# EAGLE design BMS-LV (EAGLE 6.6.0)
GLVS Battery Management System
DATABASE: D:\Greg\Dropbox\EV (1)\2016 Hardware\partsdb.txt
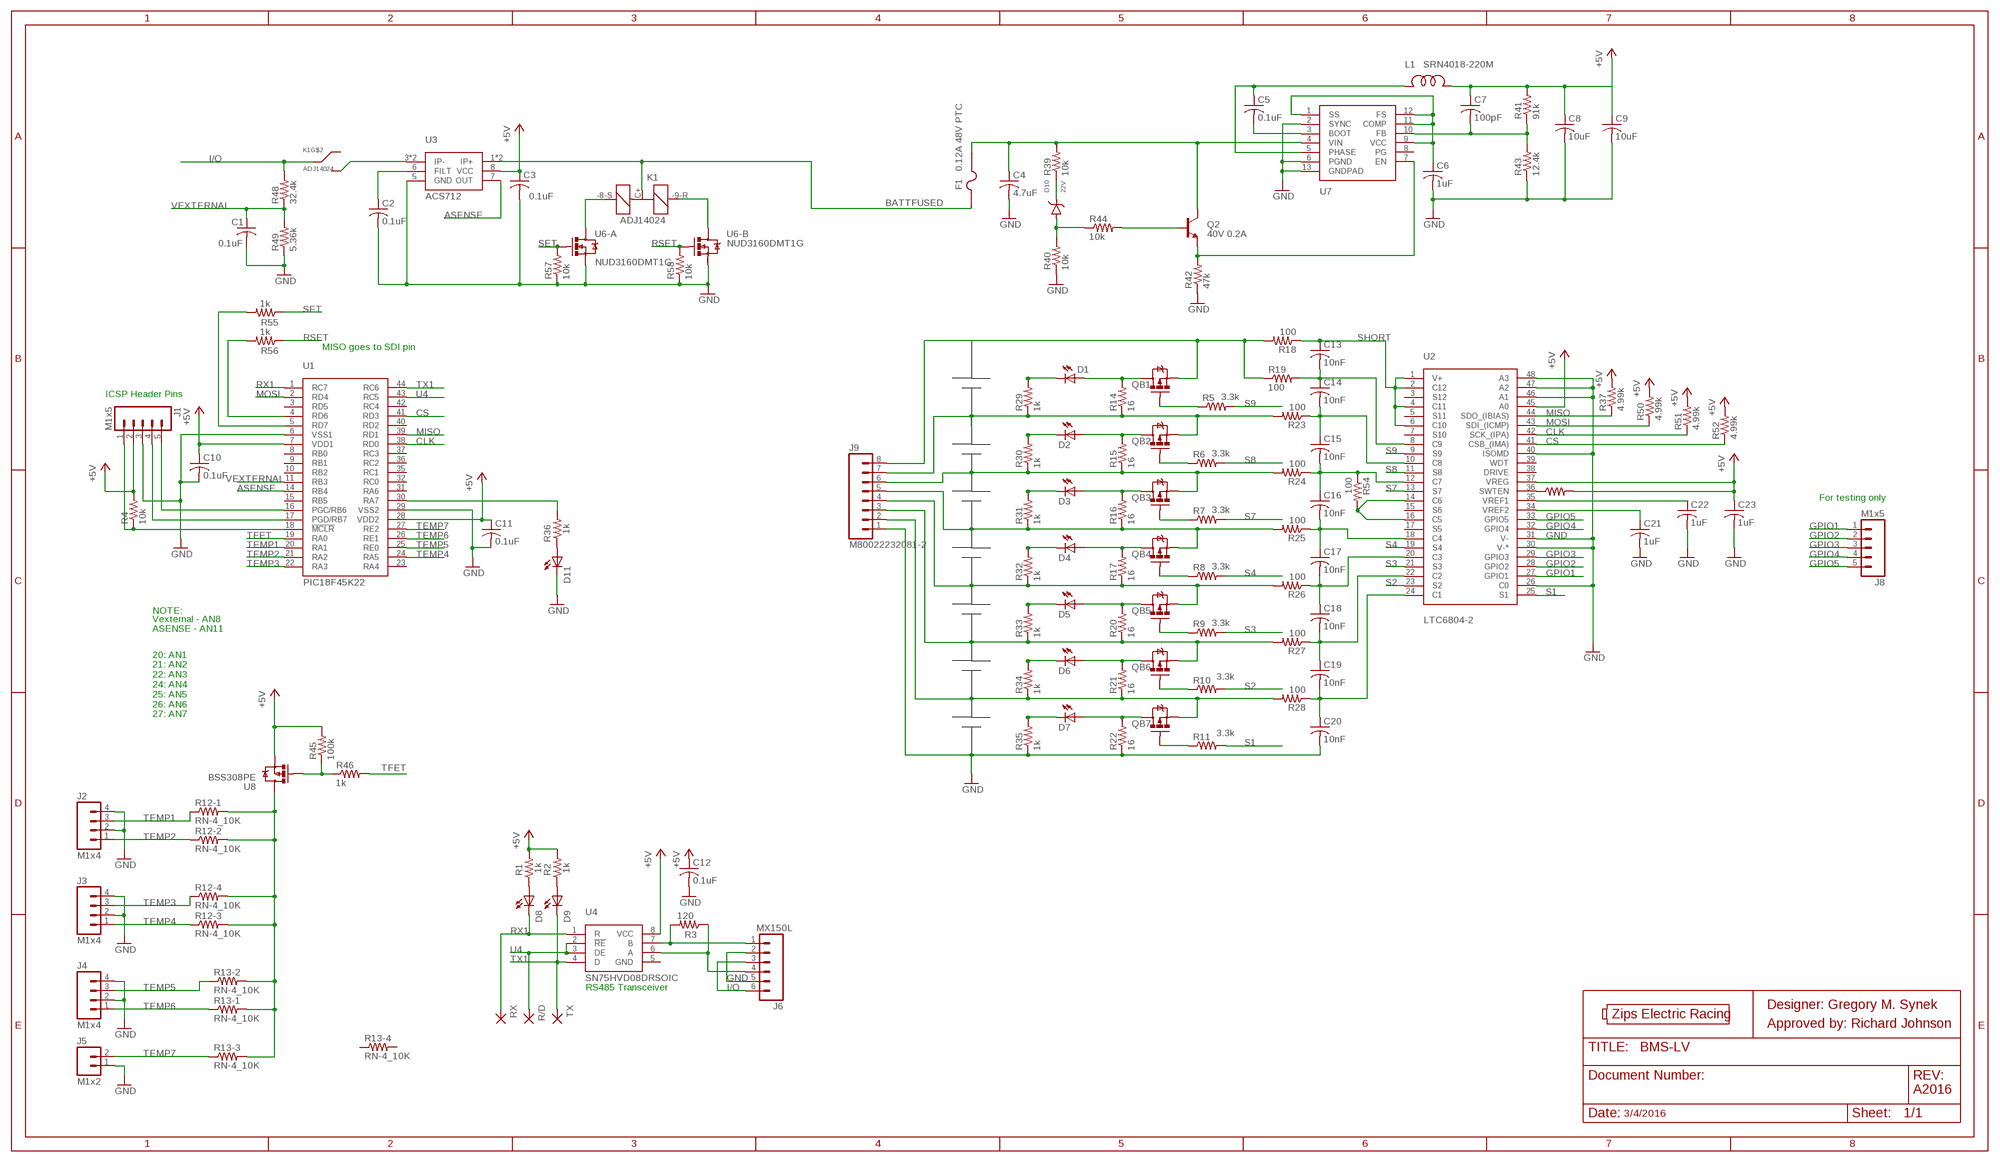
[diagram p0: schematic, sheet 1]

## Parts
C1  0.1uF  CAP_0.1UF_50V  [0603]
C2  0.1uF  CAP_0.1UF_100V  [0805]
C3  0.1uF  CAP_0.1UF_50V  [0603]
C4  4.7uF  CAP_4.7UF_50V  [1206@1]
C5  0.1uF  CAP_0.1UF_50V  [0603]
C6  1uF  CAP_1UF_50V_0805  [0805]
C7  100pF  CAP_100PF_50V  [0603]
C8  10uF  CAP_10UF_50V  [1206@1]
C9  10uF  CAP_10UF_50V  [1206@1]
C10  0.1uF  CAP_0.1UF_50V  [0603]
C11  0.1uF  CAP_0.1UF_50V  [0603]
C12  0.1uF  CAP_0.1UF_50V  [0603]
C13  10nF  CAP_10NF_50V  [0603]
C14  10nF  CAP_10NF_50V  [0603]
C15  10nF  CAP_10NF_50V  [0603]
C16  10nF  CAP_10NF_50V  [0603]
C17  10nF  CAP_10NF_50V  [0603]
C18  10nF  CAP_10NF_50V  [0603]
C19  10nF  CAP_10NF_50V  [0603]
C20  10nF  CAP_10NF_50V  [0603]
C21  1uF  CAP_1UF_50V_0805  [0805]
C22  1uF  CAP_1UF_50V_0805  [0805]
C23  1uF  CAP_1UF_50V_0805  [0805]
D1  LED_GREEN  [CHIP_LED0805]
D2  LED_GREEN  [CHIP_LED0805]
D3  LED_GREEN  [CHIP_LED0805]
D4  LED_GREEN  [CHIP_LED0805]
D5  LED_GREEN  [CHIP_LED0805]
D6  LED_GREEN  [CHIP_LED0805]
D7  LED_GREEN  [CHIP_LED0805]
D8  LED_AMBER  [CHIP_LED0805]
D9  LED_GREEN  [CHIP_LED0805]
D10  22V  DIODE-ZENER_22V  [SOD-323]
D11  LED_AMBER  [CHIP_LED0805]
F1  0.12A 48V PTC  FUSE_0.12A_48V_PTC  [1206@1]
J1  M1x5  M5GENERIC  [5X.1]
J2  M1x4  M4_1X4_LOCK  [MOLEX_1X4]
J3  M1x4  M4_1X4_LOCK  [MOLEX_1X4]
J4  M1x4  M4_1X4_LOCK  [MOLEX_1X4]
J5  M1x2  M2M1X2  [MOLEX-1X2]
J6  MX150L  M2X3MX150L  [MOLEX-MX150L]
J8  M1x5  M5GENERIC  [5X.1]
J9  M80022232081-2  [MOLEX-1X8-2]
K1  ADJ14024  [ADJ14024]
L1  SRN4018-220M  [SRN4018]
Q2  40V 0.2A  NPN_40V_0.2A  [SOT23]
QB1  MOS-P_DMP2305U-7  [SOT23]
QB2  MOS-P_DMP2305U-7  [SOT23]
QB3  MOS-P_DMP2305U-7  [SOT23]
QB4  MOS-P_DMP2305U-7  [SOT23]
QB5  MOS-P_DMP2305U-7  [SOT23]
QB6  MOS-P_DMP2305U-7  [SOT23]
QB7  MOS-P_DMP2305U-7  [SOT23]
R1  1k  RES_1K_5%  [0603]
R2  1k  RES_1K_5%  [0603]
R3  120  RES_120_1%  [0603]
R4  10k  RES_10K_1%  [0603]
R5  3.3k  RES_3.3K_1%_0805  [0805]
R6  3.3k  RES_3.3K_1%_0805  [0805]
R7  3.3k  RES_3.3K_1%_0805  [0805]
R8  3.3k  RES_3.3K_1%_0805  [0805]
R9  3.3k  RES_3.3K_1%_0805  [0805]
R10  3.3k  RES_3.3K_1%_0805  [0805]
R11  3.3k  RES_3.3K_1%_0805  [0805]
R12  RN-4_10K  [MNR14]
R13  RN-4_10K  [MNR14]
R14  16  RES_16_5%_TH  [RR02J16RTB]
R15  16  RES_16_5%_TH  [RR02J16RTB]
R16  16  RES_16_5%_TH  [RR02J16RTB]
R17  16  RES_16_5%_TH  [RR02J16RTB]
R18  100  RES_100_1%  [0603]
R19  100  RES_100_1%  [0603]
R20  16  RES_16_5%_TH  [RR02J16RTB]
R21  16  RES_16_5%_TH  [RR02J16RTB]
R22  16  RES_16_5%_TH  [RR02J16RTB]
R23  100  RES_100_1%  [0603]
R24  100  RES_100_1%  [0603]
R25  100  RES_100_1%  [0603]
R26  100  RES_100_1%  [0603]
R27  100  RES_100_1%  [0603]
R28  100  RES_100_1%  [0603]
R29  1k  RES_1K_5%  [0603]
R30  1k  RES_1K_5%  [0603]
R31  1k  RES_1K_5%  [0603]
R32  1k  RES_1K_5%  [0603]
R33  1k  RES_1K_5%  [0603]
R34  1k  RES_1K_5%  [0603]
R35  1k  RES_1K_5%  [0603]
R36  1k  RES_1K_5%  [0603]
R37  4.99k  RES_4.99K_1%  [0603]
R39  10k  RES_10K_1%  [0603]
R40  10k  RES_10K_1%  [0603]
R41  91k  RES_91K_1%_0805  [0805]
R42  47k  RES_47K_1%  [0603]
R43  12.4k  RES_12.4K_1%  [0603]
R44  10k  RES_10K_1%  [0603]
R45  100k  RES_100K_1%_0805  [0805]
R46  1k  RES_1K_1%_0805  [0805]
R47  RES_0_1%  [0603]
R48  32.4k  RES_32.4K_1%  [0603]
R49  5.36k  RES_5.36K_1%  [0603]
R50  4.99k  RES_4.99K_1%  [0603]
R51  4.99k  RES_4.99K_1%  [0603]
R52  4.99k  RES_4.99K_1%  [0603]
R54  100  RES_1K_1%_0805  [0805]
R55  1k  RES_1K_5%  [0603]
R56  1k  RES_1K_5%  [0603]
R57  10k  RES_10K_1%  [0603]
R58  10k  RES_10K_1%  [0603]
R/D  TPSMD  [0603]
RX  TPSMD  [0603]
TX  TPSMD  [0603]
U1  PIC18F45K22  [TQFP-44]
U2  LTC6804-2  [SSOP-48]
U3  ACS712  ACS712ELCTR-30A-T  [SO-8]
U4  SN75HVD08DRSOIC  [SO-8]
U6  NUD3160DMT1G  [SC74-6]
U7  ISL85415-FRZ-T7A  [DFN-12]
U8  BSS308PE  BSS308PEBSS308PE  [SOT23]

## Nets
+5V: C3.1(+) C7.1(+) C8.1(+) C9.1(+) C10.1(+) C11.1(+) C12.1(+) C23.1(+) J1.2 L1.P$2 R1.2 R2.2 R4.2 R37.2 R41.2 R45.2 R47.2 R50.2 R51.2 R52.2 U1.7(VDD1) U1.28(VDD2) U2.37(VREG) U2.45(A0) U3.8(VCC) U4.8(VCC) U8.3(S)
ASENSE: U1.14(RB4) U3.7(OUT)
BATTFUSED: F1.1 K1.C+(-) U3.1(IP+) U3.2(IP+)
BATTPACK+: J9.8 QB1.3(S) R18.2 R19.1
CLK: R51.1 U1.38(RD0) U2.42(SCK_(IPA))
CS: R52.1 U1.41(RD3) U2.41(CSB_(IMA))
GND: C1.2(-) C2.2(-) C3.2(-) C4.2(-) C6.2(-) C8.2(-) C9.2(-) C10.2(-) C11.2(-) C12.2(-) C20.2(-) C21.2(-) C22.2(-) C23.2(-) D11.C J1.3 J2.2 J2.4 J3.2 J3.4 J4.2 J4.4 J5.1 J6.2 J6.5 J9.1 R22.P$1 R35.1 R40.1 R42.1 R43.1 R49.1 R57.1 R58.1 U1.6(VSS1) U1.29(VSS2) U2.26(C0) U2.30(V-*) U2.31(V-) U2.40(ISOMD) U2.46(A1) U2.47(A2) U2.48(A3) U3.5(GND) U6.1(-A:S) U6.4(-B:S) U7.2(SYNC) U7.6(PGND) U7.13(GNDPAD)
GPIO1: J8.1 U2.27(GPIO1)
GPIO2: J8.2 U2.28(GPIO2)
GPIO3: J8.3 U2.29(GPIO3)
GPIO4: J8.4 U2.32(GPIO4)
GPIO5: J8.5 U2.33(GPIO5)
I/O: J6.3 J6.6 K1.C R48.2
MISO: R37.1 U1.39(RD1) U2.44(SDO_(IBIAS))
MOSI: R50.1 U1.2(RD4) U2.43(SDI_(ICMP))
N$1: D8.A R1.1
N$2: C13.2(-) C14.1(+) R19.2 U2.8(C9)
N$3: D9.A R2.1
N$4: C14.2(-) C15.1(+) R23.1 U2.10(C8)
N$5: D11.A R36.1
N$6: R55.2 U1.5(RD7)
N$7: K1.-8-S(+1) U6.6(-A:D)
N$9: C15.2(-) C16.1(+) R24.1 R54.1 U2.12(C7)
N$10: J1.4 U1.17(PGD/RB7)
N$11: R45.1 R46.1 U8.1(G)
N$12: R47.1 U2.36(SWTEN)
N$13: D1.C R29.2
N$14: R36.2 U1.30(RA7)
N$15: K1.NO U3.3(IP-) U3.4(IP-)
N$16: C17.2(-) C18.1(+) R26.1 U2.20(C3)
N$18: R54.2 U2.14(C6) U2.16(C5)
N$19: R56.2 U1.4(RD6)
N$20: K1.-9-R(+2) U6.3(-B:D)
N$22: D2.C R30.2
N$24: C4.1(+) F1.2 Q2.3 R39.2 U7.4(VIN)
N$27: C2.1(+) U3.6(FILT)
N$28: D10.P$2(A) R40.2 R44.1
N$29: J6.4 R3.1 U4.6(A)
N$30: D10.P$1(C) R39.1
N$31: Q2.2 R42.2 U7.7(EN)
N$32: C5.2(-) U7.3(BOOT)
N$33: J6.1 R3.2 U4.7(B)
N$34: J9.2 QB7.3(S) R21.P$1 R28.2 R34.1
N$35: C6.1(+) U7.1(SS) U7.9(VCC) U7.11(COMP) U7.12(FS)
N$36: C5.1(+) L1.P$1 U7.5(PHASE)
N$38: C18.2(-) C19.1(+) R27.1 U2.22(C2)
N$39: J1.5 U1.16(PGC/RB6)
N$40: C19.2(-) C20.1(+) R28.1 U2.24(C1)
N$41: D3.C R31.2
N$42: Q2.1 R44.2
N$43: D4.C R32.2
N$44: D5.C R33.2
N$46: QB5.1(G) R9.1
N$47: D6.C R34.2
N$48: D5.A QB5.2(D) R20.P$2
N$49: QB3.1(G) R7.1
N$50: J9.3 QB6.3(S) R20.P$1 R27.2 R33.1
N$52: QB7.1(G) R11.1
N$53: J9.4 QB5.3(S) R17.P$1 R26.2 R32.1
N$54: D7.A QB7.2(D) R22.P$2
N$56: D7.C R35.2
N$57: QB6.1(G) R10.1
N$58: J1.1 R4.1 U1.18(!MCLR)
N$64: D6.A QB6.2(D) R21.P$2
N$66: C7.2(-) R41.1 R43.2 U7.10(FB)
N$67: J9.7 QB2.3(S) R14.P$1 R23.2 R29.1
N$68: J9.6 QB3.3(S) R15.P$1 R24.2 R30.1
N$69: J9.5 QB4.3(S) R16.P$1 R25.2 R31.1
N$70: QB1.1(G) R5.1
N$71: D1.A QB1.2(D) R14.P$2
N$72: QB2.1(G) R6.1
N$73: D2.A QB2.2(D) R15.P$2
N$74: D3.A QB3.2(D) R16.P$2
N$76: QB4.1(G) R8.1
N$77: D4.A QB4.2(D) R17.P$2
N$78: R12.5 R12.6 R12.7 R12.8 R13.6 R13.7 R13.8 U8.2(D)
N$79: C16.2(-) C17.1(+) R25.1 U2.18(C4)
RSET: R56.1 R58.2 U6.5(-B:G)
RX1: D8.C RX.1 RX.2 U1.1(RC7) U4.1(R)
S1: R11.2 U2.25(S1)
S2: R10.2 U2.23(S2)
S3: R9.2 U2.21(S3)
S4: R8.2 U2.19(S4)
S7: R7.2 U2.13(S7)
S8: R6.2 U2.11(S8)
S9: R5.2 U2.9(S9)
SET: R55.1 R57.2 U6.2(-A:G)
SHORT: C13.1(+) R18.1 U2.1(V+) U2.2(C12) U2.4(C11) U2.6(C10)
TEMP1: J2.3 R12.1 U1.20(RA1)
TEMP2: J2.1 R12.2 U1.21(RA2)
TEMP3: J3.3 R12.4 U1.22(RA3)
TEMP4: J3.1 R12.3 U1.24(RA5)
TEMP5: J4.3 R13.2 U1.25(RE0)
TEMP6: J4.1 R13.1 U1.26(RE1)
TEMP7: J5.2 R13.3 U1.27(RE2)
TFET: R46.2 U1.19(RA0)
TX1: D9.C TX.1 TX.2 U1.44(RC6) U4.4(D)
U4: R/D.1 R/D.2 U1.43(RC5) U4.2(!RE) U4.3(DE)
VEXTERNAL: C1.1(+) R48.1 R49.2 U1.11(RB3)
VREF1: C22.1(+) U2.35(VREF1)
VREF2: C21.1(+) U2.34(VREF2)
Unconnected: K1.NC R13.4 R13.5 U1.3(RD5) U1.8(RB0) U1.9(RB1) U1.10(RB2) U1.15(RB5) U1.23(RA4) U1.31(RA6) U1.32(RC0) U1.35(RC1) U1.36(RC2) U1.37(RC3) U1.40(RD2) U1.42(RC4) U2.3(S12) U2.5(S11) U2.7(S10) U2.15(S6) U2.17(S5) U2.38(DRIVE) U2.39(WDT) U4.5(GND) U7.8(PG)

## Notes on the sheet
- MISO goes to SDI pin
- ICSP Header Pins
- For testing only
- NOTE:
- Vexternal - AN8
  ASENSE - AN11
- 20: AN1
  21: AN2
  22: AN3
  24: AN4
  25: AN5
  26: AN6
  27: AN7
- RS485 Transceiver
- Designer: Gregory M. Synek
- Zips Electric Racing
- Approved by: Richard Johnson
- A2016
- 3/4/2016

## Library data of the parts
C1 C3 C5 C10-C12 = FSAE Electric:CAP; PARTNO: CC0603ZRY5V9BB104
C2 = FSAE Electric:CAP; PARTNO: CL21B104KCC5PNC
C4 = FSAE Electric:CAP; PARTNO: GRM31CF51H475ZA01L
C6 C21-C23 = FSAE Electric:CAP; PARTNO: UMK212F105ZG-T
C7 = FSAE Electric:CAP; PARTNO: C1608C0G1H101J080AA
C8 C9 = FSAE Electric:CAP; PARTNO: CL31A106KBHNNNE
C13-C20 = FSAE Electric:CAP; PARTNO: CL10F103ZB8NNNC
D1-D7 D9 = FSAE Electric:LED; PARTNO: LTST-S220GKT
D8 D11 = FSAE Electric:LED; PARTNO: HSMA-C170
D10 = FSAE Electric:DIODE-ZENER: Zener Diodes; PARTNO: MM3Z22VT1G
F1 = FSAE Electric:FUSE; PARTNO: 0ZCJ0012FF2E
J1 J8 = FSAE Electric:M5: Molex 5-Pin Connectors; PARTNO: GENERIC
J2-J4 = FSAE Electric:M4: Molex 1x4 Connectors; PARTNO: 0022232041
J5 = FSAE Electric:M2; PARTNO: 0022232021
J6 = FSAE Electric:M2X3: Molex 2x3 Pin Connectors; PARTNO: 19427-0018
J9 = FSAE Electric:M8: Molex 8-pin Connectors; PARTNO: 0022232081
K1 = FSAE Electric:ADJ14024: General Purpose Relay SPDT 16A 24V View on DigiKey <http://www.digikey.com/product-search/en?keywords=ADJ14024>; PARTNO: ADJ14024
L1 = FSAE Electric:SRN4018: Fixed Inductor; PARTNO: SRN4018-220M
Q2 = FSAE Electric:NPN: NPN Transistors; PARTNO: MMBT3904LT1G
QB1-QB7 = FSAE Electric:MOS-P: P-Channel Mosfets; PARTNO: DMP2305U-7
R1 R2 R29-R36 R55 R56 = FSAE Electric:RES: Resistors; PARTNO: RC0603JR-071KL
R3 = FSAE Electric:RES: Resistors; PARTNO: RC0603FR-07120RL
R4 R39 R40 R44 R57 R58 = FSAE Electric:RES: Resistors; PARTNO: RC0603FR-0710KL
R5-R11 = FSAE Electric:RES: Resistors; PARTNO: RC0805FR-073K3L
R12 R13 = FSAE Electric:RN-4; PARTNO: MNR14ERAPJ103
R14-R17 R20-R22 = FSAE Electric:RES: Resistors; PARTNO: RR02J16RTB
R18 R19 R23-R28 = FSAE Electric:RES: Resistors; PARTNO: RC0603FR-07100RL
R37 R50-R52 = FSAE Electric:RES: Resistors; PARTNO: ERJ-3EKF4991V
R41 = FSAE Electric:RES: Resistors; PARTNO: ERJ-6ENF9102V
R42 = FSAE Electric:RES: Resistors; PARTNO: RC0603FR-0747KL
R43 = FSAE Electric:RES: Resistors; PARTNO: RC0603FR-0712K4L
R45 = FSAE Electric:RES: Resistors; PARTNO: RC0805FR-07100KL
R46 R54 = FSAE Electric:RES: Resistors; PARTNO: RC0805FR-071KL
R47 = FSAE Electric:RES: Resistors; PARTNO: CRCW06030000Z0EA
R48 = FSAE Electric:RES: Resistors; PARTNO: RC0603FR-0732K4L
R49 = FSAE Electric:RES: Resistors; PARTNO: RC0603FR-075K36L
R/D RX TX = FSAE Electric:TP: SMD test points to make life easy to test / debug; PARTNO: 1625854-3
U1 = FSAE Electric:PIC18F45K22: Microprocessor used in many places on the car View on DigiKey <http://www.digikey.com/product-detail/en/PIC18F45K22T-I%2FPT/PIC18F45K22T-I%2FPTCT-ND/5169582>; PARTNO: PIC18F45K22T-I/PT
U2 = FSAE Electric:LTC6804: The LTC6804 is a multicell battery stack monitor that measures up to 12 series connected battery cells with a total measurement error of less than 1.2mV. The cell measurement range of 0V to 5V makes the LTC6804 suitable for most battery chemistries. All 12 cell voltages can be captured in 290µs, and lower data acquisition rates can be selected for high noise reduction; PARTNO: LTC6804IG-2#PBF
U3 = FSAE Electric:ACS712: Hall Effect Current Sensor 30A View on DigiKey <http://www.digikey.com/product-detail/en/ACS712ELCTR-30A-T/620-1191-1-ND/1284608>; PARTNO: ACS712ELCTR-30A-T
U4 = FSAE Electric:SN75HVD08DR: RS485 Transceiver View on DigiKey <http://www.digikey.com/product-detail/en/SN75HVD08DR/296-37893-1-ND/4899996>; PARTNO: SN75HVD08DR
U6 = FSAE Electric:NUD3160DMT1G; PARTNO: NUD3160DMT1G
U7 = FSAE Electric:ISL85415: 5V Buck Regulator IC 500mA 3V-36V View on DigiKey <http://www.digikey.com/product-detail/en/ISL85415FRZ-T7A/ISL85415FRZ-T7ACT-ND/4486023>; PARTNO: ISL85415FRZ-T7A
U8 = FSAE Electric:BSS308PE: P-Ch Mosfet 30V 2A View on DigiKey <http://www.digikey.com/product-detail/en/BSS308PE%20H6327/BSS308PE%20H6327CT-ND/3196649>; PARTNO: BSS308PE H6327

## Board
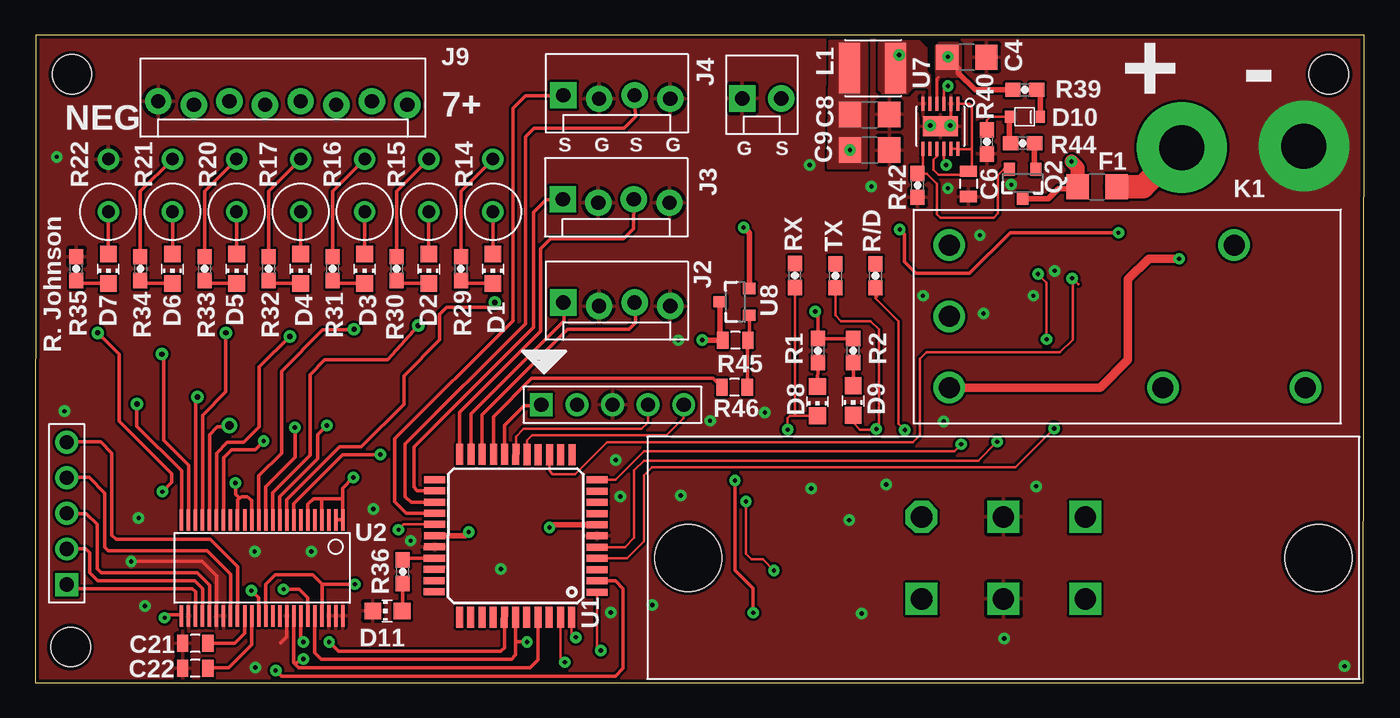
[diagram p1: board, top side]
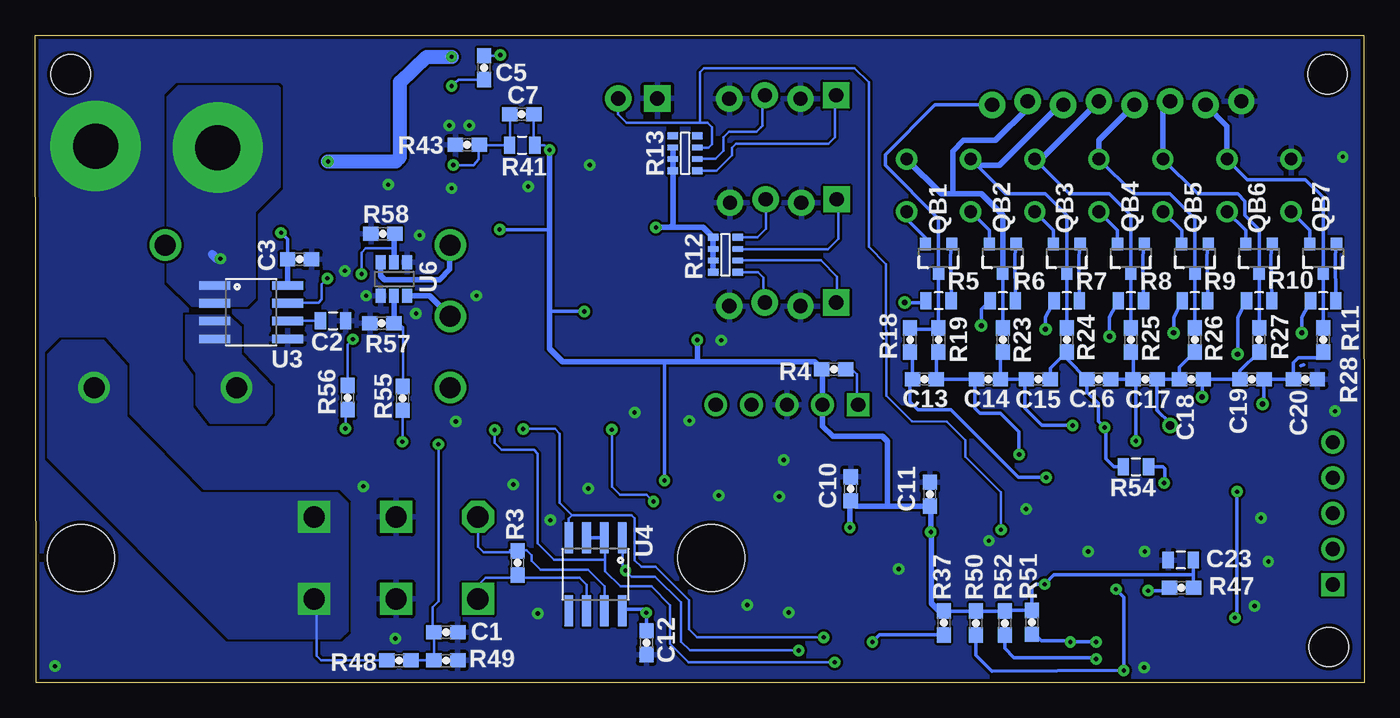
[diagram p2: board, bottom side, seen from below]

Size 94.84 x 46.18 mm. Coordinates in mm from the lower left corner, seen from the top.
Outline: 94.74,0 94.84,46.18 0.05,46.18 0,0 94.74,0
Copper layers (1*16): Top 0.035mm / dielectric 1.5mm / Bottom 0.035mm
Design rules "SparkFun *": minimum track width 7mil, minimum drill 12mil, track to track 7mil, track to pad 7mil, pad to pad 7mil, via to via 7mil, smd to smd 7mil, copper to edge 10mil, drill to drill 7mil, minimum pad ring 12mil, minimum via ring 10mil, stop-mask expansion 4mil, vias tented up to drill 25mil, thermal gap 10mil
Holes 2.8 mm at 92.3,43.38 2.64,43.38 2.54,2.54

### Footprints (pad centres in the part's own frame; a part is rotated, then mirrored left to right if it is on the bottom)
0603 = smd 1.1 x 1: 1 -0.85,0; 2 0.85,0
0805 = smd 0.8 x 1.2: 1 -0.9,0; 2 0.9,0
1206@1 = smd 1.6 x 1.8: 1 -1.4,0; 2 1.4,0
CHIP_LED0805 = smd 1.2 x 1.2: A 0,-1.05; C 0,1.05
SOD-323 = smd 0.65 x 0.85: P$1 -1.1,0; P$2 1.1,0
5X.1 = drill 1.016 square: 1 -5.08,0 | drill 1.016: 2 -2.54,0; 3 0,0; 4 2.54,0; 5 5.08,0
MOLEX_1X4 = drill 1.016 pad 1.88 square: 1 -3.81,0.127 | drill 1.016 pad 1.88: 2 -1.27,-0.127; 3 1.27,0.127; 4 3.81,-0.127
MOLEX-1X2 = drill 1.016 pad 1.88 square: 1 -1.397,0 | drill 1.016 pad 1.88: 2 1.397,0
MOLEX-MX150L = drill 1.524 octagon: 1 -5.842,2.921 | drill 1.524 square: 2 0,2.921; 3 5.842,2.921; 4 -5.842,-2.921; 5 0,-2.921; 6 5.842,-2.921 | hole 4.775: -22.479,0; 22.479,0
MOLEX-1X8-2 = drill 1.016 pad 1.88: 1 -8.89,0; 2 -6.35,-0.254; 3 -3.81,0; 4 -1.27,-0.254; 5 1.27,0; 6 3.81,-0.254; 7 6.35,0; 8 8.89,-0.254
ADJ14024 = drill 1.5: -8-S 0,5.08; -9-R 0,0; C 25.4,-5.08; C+ 0,-5.08; NC 20.32,5.08; NO 15.24,-5.08
SRN4018 = smd 1.5 x 3.6: P$1 -1.6,0; P$2 1.7,0
SOT23 = smd 0.8 x 0.9: 1 -0.95,-1; 2 0.95,-1; 3 0,1.1
MNR14 = smd 0.5 x 0.75: 1 -1.25,-0.9; 4 1.25,-0.9; 5 1.25,0.85; 8 -1.25,0.85 | smd 0.4 x 0.75: 2 -0.4,-0.9; 3 0.4,-0.9; 6 0.4,0.85; 7 -0.4,0.85
RR02J16RTB = drill 0.9: P$1 -3.75,0; P$2 0,0
TQFP-44 = smd 1.5 x 0.5: 1 -5.8,4; 2 -5.8,3.2; 3 -5.8,2.4; 4 -5.8,1.6; 5 -5.8,0.8; 6 -5.8,0; 7 -5.8,-0.8; 8 -5.8,-1.6; 9 -5.8,-2.4; 10 -5.8,-3.2; 11 -5.8,-4; 23 5.8,-4; 24 5.8,-3.2; 25 5.8,-2.4; 26 5.8,-1.6; 27 5.8,-0.8; 28 5.8,0; 29 5.8,0.8; 30 5.8,1.6; 31 5.8,2.4; 32 5.8,3.2; 33 5.8,4 | smd 0.5 x 1.5: 12 -4,-5.8; 13 -3.2,-5.8; 14 -2.4,-5.8; 15 -1.6,-5.8; 16 -0.8,-5.8; 17 0,-5.8; 18 0.8,-5.8; 19 1.6,-5.8; 20 2.4,-5.8; 21 3.2,-5.8; 22 4,-5.8; 34 4,5.8; 35 3.2,5.8; 36 2.4,5.8; 37 1.6,5.8; 38 0.8,5.8; 39 0,5.8; 40 -0.8,5.8; 41 -1.6,5.8; 42 -2.4,5.8; 43 -3.2,5.8; 44 -4,5.8
SSOP-48 = smd 0.25 x 1.524: 1 -5.75,-3.421; 2 -5.25,-3.421; 3 -4.75,-3.421; 4 -4.25,-3.421; 5 -3.75,-3.421; 6 -3.25,-3.421; 7 -2.75,-3.421; 8 -2.25,-3.421; 9 -1.75,-3.421; 10 -1.25,-3.421; 11 -0.75,-3.421; 12 -0.25,-3.421; 13 0.25,-3.421; 14 0.75,-3.421; 15 1.25,-3.421; 16 1.75,-3.421; 17 2.25,-3.421; 18 2.75,-3.421; 19 3.25,-3.421; 20 3.75,-3.421; 21 4.25,-3.421; 22 4.75,-3.421; 23 5.25,-3.421; 24 5.75,-3.421; 25 5.75,3.421; 26 5.25,3.421; 27 4.75,3.421; 28 4.25,3.421; 29 3.75,3.421; 30 3.25,3.421; 31 2.75,3.421; 32 2.25,3.421; 33 1.75,3.421; 34 1.25,3.421; 35 0.75,3.421; 36 0.25,3.421; 37 -0.25,3.421; 38 -0.75,3.421; 39 -1.25,3.421; 40 -1.75,3.421; 41 -2.25,3.421; 42 -2.75,3.421; 43 -3.25,3.421; 44 -3.75,3.421; 45 -4.25,3.421; 46 -4.75,3.421; 47 -5.25,3.421; 48 -5.75,3.421
SO-8 = smd 0.61 x 2.21: 1 -1.905,-2.616; 2 -0.635,-2.616; 3 0.635,-2.616; 4 1.905,-2.616; 5 1.905,2.616; 6 0.635,2.616; 7 -0.635,2.616; 8 -1.905,2.616
SC74-6 = smd 0.7 x 1: 1 -0.95,-1.2; 2 0,-1.2; 3 0.95,-1.2; 4 0.95,1.2; 5 0,1.2; 6 -0.95,1.2
DFN-12 = smd 0.23 x 1: 1 1.25,1.6; 2 0.75,1.6; 3 0.25,1.6; 4 -0.25,1.6; 5 -0.75,1.6; 6 -1.25,1.6; 7 -1.25,-1.6; 8 -0.75,-1.6; 9 -0.25,-1.6; 10 0.25,-1.6; 11 0.75,-1.6; 12 1.25,-1.6 | smd 2.5 x 1.4: 13 0,0

### Placement (x,y rotation side)
C1  65.53,3.58 0.3 bottom
C2  73.58,25.81 0 bottom
C3  75.97,30.18 0 bottom
C4  66.47,44.6 0 top
C5  62.8,43.85 270 bottom
C6  66.6,35.56 270 top
C7  60.12,40.53 180 bottom
C8  59.54,40.51 0 top
C9  59.54,37.97 0 top
C10  36.65,13.82 90 bottom
C11  31.01,13.44 90 bottom
C12  51.23,2.84 270 bottom
C13  31.39,21.64 0 bottom
C14  26.82,21.64 0 bottom
C15  23.27,21.64 0 bottom
C16  18.95,21.64 0 bottom
C17  15.65,21.64 0 bottom
C18  12.34,21.64 0 bottom
C19  8.03,21.64 0 bottom
C20  4.22,21.64 0 bottom
C21  11.43,2.79 180 top
C22  11.43,1.02 180 top
C23  13.11,8.74 180 bottom
D1  32.66,29.51 180 top
D2  28.09,29.51 180 top
D3  23.52,29.51 180 top
D4  18.95,29.51 180 top
D5  14.38,29.51 180 top
D6  9.8,29.51 180 top
D7  5.23,29.51 180 top
D8  55.83,20.07 180 top
D9  58.37,20.12 180 top
D10  70.61,40.36 180 top
D11  25.15,5.11 90 top
F1  75.77,35.36 180 top
J1  41.2,19.81 0 top
J2  41.5,26.97 0 top
J3  41.45,34.34 0 top
J4  41.5,41.76 0 top
J5  51.84,41.66 0 top
J6  69.09,8.89 0 top
J8  2.26,12.06 90 top
J9  17.68,41.45 0 top
K1  65.23,26.11 0 top
L1  59.79,43.81 180 top
Q2  70.46,35.61 180 top
QB1  30.38,30.28 180 bottom
QB2  25.81,30.28 180 bottom
QB3  21.23,30.28 180 bottom
QB4  16.66,30.28 180 bottom
QB5  12.09,30.28 180 bottom
QB6  7.52,30.28 180 bottom
QB7  2.95,30.28 180 bottom
R1  55.85,23.67 90 top
R2  58.37,23.67 90 top
R3  60.43,8.53 90 bottom
R4  37.86,22.34 180 bottom
R5  30.38,27.23 180 bottom
R6  25.81,27.23 180 bottom
R7  21.23,27.23 180 bottom
R8  16.66,27.23 180 bottom
R9  12.09,27.23 180 bottom
R10  7.52,27.23 180 bottom
R11  2.95,27.23 180 bottom
R12  45.62,30.51 90 bottom
R13  48.49,37.74 90 bottom
R14  32.66,33.58 270 top
R15  28.09,33.58 270 top
R16  23.52,33.58 270 top
R17  18.95,33.58 270 top
R18  32.41,24.43 90 bottom
R19  30.38,24.43 270 bottom
R20  14.38,33.58 270 top
R21  9.8,33.58 270 top
R22  5.23,33.58 270 top
R23  25.81,24.43 90 bottom
R24  21.23,24.43 90 bottom
R25  16.66,24.43 90 bottom
R26  12.09,24.43 90 bottom
R27  7.52,24.43 90 bottom
R28  2.95,24.43 90 bottom
R29  30.38,29.51 270 top
R30  25.81,29.51 270 top
R31  21.23,29.51 270 top
R32  16.66,29.51 270 top
R33  12.09,29.51 270 top
R34  7.52,29.51 270 top
R35  2.95,29.51 270 top
R36  26.24,7.9 90 top
R37  30.01,4.25 90 bottom
R39  70.61,42.27 180 top
R40  67.89,38.56 90 top
R41  60.1,38.33 0 bottom
R42  62.97,35.46 90 top
R43  64.01,38.34 0 bottom
R44  70.46,38.46 0 top
R45  49.96,24.41 180 top
R46  49.91,21.06 180 top
R47  13.06,6.76 0 bottom
R48  68.88,1.57 180 bottom
R49  65.53,1.57 180 bottom
R50  27.71,4.24 90 bottom
R51  23.72,4.29 90 bottom
R52  25.65,4.24 90 bottom
R54  16.31,15.39 0 bottom
R55  68.63,20.27 270 bottom
R56  72.54,20.32 270 bottom
R57  70.1,25.63 0 bottom
R58  70.03,32 0 bottom
R/D  59.97,29.01 90 top
RX  54.2,29.03 90 top
TX  57.1,29.01 90 top
U1  34.29,10.46 179.9 top
U2  16.21,8.18 180 top
U3  79.43,26.42 270 bottom
U4  54.86,7.72 180 bottom
U6  69.24,28.78 0 bottom
U7  64.59,39.67 0 top
U8  49.96,27.15 90 top

### Tracks (layer width: path | path; a pad name or v marks a point on that pad's centre or on a via)
+5V  (via drill 0.3)
  Top 0.178: C9.1 58.14,38.38 58.24,38.48
  Top 0.254: R2.2 R1.2 55.85,26.26 v55.65,26.47 | 57.93,44.23 L1.P$2 | 20.47,7.01 19.81,7.67 17.12,7.67 16.45,7.01 U2.37 | 20.47,7.01 20.47,4.78 U2.45 | v22.81,7.01 20.47,7.01 | v51.23,4.98 51.23,6.73 49.94,8.03 v49.94,14.4 | v77.29,32.08 69.57,32.08 66.67,29.18 62.84,29.18 62.03,30 62.03,31.98 v61.7,32.31
  Top 0.406: U1.28 30.67,10.47 v30.94,10.74 | U1.7 36.91,11.26 v36.7,11.05 | U8.3 48.86,24.61 R45.2 47.62,24.41 v47.6,24.43
  Bottom 0.178: C9.1 58.49,38.33 R41.2 59.27,38.4 C7.1
  Bottom 0.254: R37.2 30,5.09 R50.2 R52.2 25.6,5.14 R51.2 23.72,6.76 23.47,7.01 v22.81,7.01 22.15,7.67 12.24,7.67 12.21,7.63 R47.2 C23.1 | C12.1 v51.23,4.98 51.49,5.23 52.83,5.23 U4.8 | v55.65,26.47 57.96,26.47 58.14,26.29 | v49.94,14.4 49.94,22.81 50.01,22.89 | U3.8 76.81,31.6 v77.29,32.08 | v61.7,32.31 58.16,32.31 58.14,32.28
  Bottom 0.406: C3.1 76.82,28.33 U3.8 | R37.2 30.35,5.1 30.89,5.64 30.89,10.69 v30.94,10.74 30.94,12.51 C11.1 34.11,12.59 | v36.7,11.05 36.7,12.92 C10.1 36.27,12.59 34.11,12.59 | 34.11,12.59 34.04,12.66 34.04,17.2 34.39,17.55 37.92,17.55 38.66,18.29 J1.2 38.66,22.29 R4.2 39.26,22.89 47.57,22.89 | C9.1 58.14,32.28 58.14,26.29 58.14,23.82 57.2,22.89 50.01,22.89 47.57,22.89 | v47.6,24.43 47.6,22.91 47.57,22.89
  other vias: 58.14,37.97
  pour Top (no thermals): 56.72,45.75 59.31,45.75 59.28,36.7 56.62,36.7 56.72,43.59
ASENSE  (via drill 0.3)
  Top 0.178: U1.14 36.7,15.09 36.93,14.86 38.53,14.86 40.82,17.14 62.64,17.14 63.14,17.65 63.14,23.09 63.6,23.55 73.13,23.55 74.04,24.46 74.04,28.78 v73.99,28.83 74.42,28.4
  Bottom 0.178: v73.99,28.83 73.99,28.8 74.4,28.4 74.4,27.33 74.62,27.1 76.76,27.1 U3.7
BATTFUSED  (via drill 0.3, 3.2 pad 6.45)
  Top 0.61: K1.C+ 76,21.03 77.98,23.01 77.98,28.75 79.45,30.23 v81.61,30.23
  Top 1.676: F1.1 79.02,35.36 v81.81,38.15
  Bottom 0.61: v81.61,30.23 81.89,30.23 82.22,30.56
  pour Bottom (no thermals): 77.55,42.49 84.58,42.49 85.34,41.73 85.34,28.6 83.64,26.9 79.76,26.9 79.2,27.46 79.2,33.58 77.42,35.36 77.42,42.37
BATTPACK+
  Bottom 0.254: J9.8 30.63,41.2 34.19,37.64 34.19,36.88 30.38,33.07 QB1.3 R19.1 30.54,25.29 30.63,25.2 32.32,25.2 R18.2 32.58,25.45
CLK  (via drill 0.3)
  Top 0.254: U1.38 33.48,2.49 33.22,2.23 21.64,2.23 v20.98,2.9 | v19.15,2.9 19.1,2.9 18.95,3.05 18.95,4.75 U2.42
  Bottom 0.254: v19.15,2.9 v20.98,2.9 21.08,3 23.06,3 23.51,3.44 R51.1
CS  (via drill 0.3)
  Top 0.254: U1.41 35.88,1.64 35.31,1.07 18.8,1.07 18.57,1.29 | 18.57,1.29 18.44,1.42 18.44,4.74 U2.41 | v19.15,1.68 18.95,1.68 18.57,1.29
  Bottom 0.254: R52.1 25.65,2.44 24.99,1.78 19.25,1.78 v19.15,1.68
GND  (via drill 0.3, 3.2 pad 6.45)
  Top 0.178: U7.2 65.34,40.42 U7.13
  Top 0.254: 61.24,38.28 C9.2 | U2.40 17.95,3.27 17.53,2.85 | U2.30 12.96,7.62 11.94,8.64 v6.86,8.64
  Bottom 0.254: v6.86,8.64 6.6,8.64
  other vias: 69.65,35.51 65.13,35.26 63.86,39.73 65.28,39.73 26.8,10.11 33.22,8.1 44.04,5.54 46.08,13.34 45.9,24.41 7.39,11.73 15.67,9.35 19.71,9.35 24.13,12.37 7.85,5.46 15.72,1.07 2.11,19.35 1.55,37.49 55.27,36.91 59.66,35.38 63.35,27.58 64.82,18.62 52.07,19.25 48.16,18.67 55.37,13.84 58.09,11.58 60.73,14.12 58.98,4.93 69.14,3.15 71.42,14 93.42,1.17 41.07,5 41.76,13.26 41.43,15.88 90.53,38.25 67.41,31.9 67.67,26.31 71.22,27.58 72.75,29.36
  pour Top (rank 6): 0,0 0.05,46.18 94.84,46.18 94.74,0
  pour Bottom (rank 6): 0,0 0.05,46.18 94.79,46.18 94.49,0
GPIO1
  Top 0.254: U2.27 11.46,6.48 11.23,6.71 2.54,6.71 J8.1
GPIO2
  Top 0.254: U2.28 11.96,6.69 11.38,7.26 4.47,7.26 3.91,7.82 3.91,9.25 3.61,9.55 2.29,9.55 J8.2
GPIO3
  Top 0.254: U2.29 12.46,6.95 11.58,7.82 4.72,7.82 4.42,8.13 4.42,11.28 3.66,12.04 2.29,12.04 J8.3
GPIO4
  Top 0.254: U2.32 13.96,7.74 12.29,9.4 5.23,9.4 4.98,9.65 4.98,13.51 3.86,14.63 2.29,14.63 J8.4
GPIO5
  Top 0.254: U2.33 14.46,8.25 12.5,10.21 5.79,10.21 5.49,10.52 5.49,16.36 4.67,17.17 2.29,17.17 J8.5
I/O
  Bottom 0.178: R48.2 74.42,1.57 74.75,1.91 74.75,5.13 74.65,5.23 74.65,5.69 J6.6
  pour Bottom (no thermals): 73.3,13.46 83.01,13.46 88.39,18.95 88.39,22.56 89.97,24.33 92.86,24.38 93.88,23.37 93.88,16.05 81.03,3.2 73.1,3.2 72.59,3.71 72.59,12.75
MISO  (via drill 0.3)
  Top 0.254: U1.39 34.28,2.9 | 34.28,2.9 34.28,1.97 33.98,1.68 20.42,1.68 19.96,2.13 19.96,4.75 U2.44 | v35.1,2.9 34.28,2.9
  Bottom 0.254: R37.1 34.59,3.4 v35.1,2.9
MOSI  (via drill 0.3)
  Top 0.254: U1.2 41.41,7.25 41.96,6.71 41.96,1.02 41.4,0.46 17.58,0.46 v17.17,0.86 | v17.73,6.66 18.85,6.66 19.46,6.04 U2.43
  Bottom 0.254: v17.73,6.66 17.17,6.1 v17.17,0.86 17.22,0.86 26.57,0.81 27.71,1.96 R50.1
N$1
  Top 0.254: D8.A R1.1
N$2  (via drill 0.3)
  Top 0.254: U2.8 18.45,12.77 21.95,16.26 v24.64,16.26
  Bottom 0.254: R19.2 30.54,23.42 C13.2 C14.1 27.79,21.53 27.79,19.56 27.43,19.2 25.96,19.2 24.64,17.88 v24.64,16.26
N$3
  Top 0.254: D9.A R2.1
N$4  (via drill 0.3)
  Top 0.254: U2.10 17.45,13.24 20.17,15.95 20.17,17.68 v20.83,18.34
  Bottom 0.254: R23.1 25.97,23.42 C14.2 C15.1 24.23,21.53 24.23,19.56 23.01,18.34 v20.83,18.34
N$5
  Top 0.254: R36.1 26.24,5.15 D11.A
N$6  (via drill 0.3)
  Top 0.178: U1.5 42.09,9.65 42.75,10.31 42.75,15.14 43.43,15.82 67.28,15.82 v68.63,17.17
  Bottom 0.178: v68.63,17.17 R55.2
N$7
  Bottom 0.406: U6.6 70.19,29.02 69.9,28.73 65.99,28.73 65.25,29.46 65.25,31.17 K1.-8-S
N$8
  Bottom 0.254: 4.34,22.66 4.53,22.6
N$9  (via drill 0.3)
  Top 0.254: v18.54,18.19 18.54,16.05 16.45,13.97 U2.12
  Bottom 0.254: 22.5,21.55 C15.2 22.42,22.4 R24.1 21.23,23.08 C16.1 19.8,20.71 19,19.91 19,18.64 v18.54,18.19 18.47,18.11 18.47,15.98 17.88,15.39 R54.1
N$10
  Top 0.178: U1.17 34.3,17.54 34.85,18.09 43.28,18.09 43.74,18.54 J1.4
N$11
  Top 0.254: U8.1 50.96,24.51 R45.1 50.81,24.36 R46.1
N$12  (via drill 0.3)
  Top 0.254: U2.36 15.96,6.04 v15.44,6.55
  Bottom 0.254: v15.44,6.55 14.11,6.55 R47.1
N$13
  Top 0.254: D1.C 30.58,28.46 R29.2
N$14
  Top 0.254: U1.30 26.36,8.88 R36.2
N$15
  pour Bottom (no thermals): 77.98,21.08 80.19,23.42 80.19,25.35 81.03,26.16 84.07,26.16 84.07,23.11 83.31,22.1 83.31,19.81 82.3,18.54 78.49,18.54 77.95,19.2
N$16  (via drill 0.6)
  Top 0.254: U2.20 12.46,17.69 13.01,18.24 13.77,18.24 v13.87,18.34
  Bottom 0.254: C17.2 C18.1 13.19,22.48 R26.1 | 14.63,21.48 C17.2 | 14.75,19.37 14.8,19.41 | 14.8,19.41 C17.2 | v13.87,18.34 13.84,18.48 14.8,19.41
N$18  (via drill 0.3)
  Top 0.254: U2.16 14.46,13.03 14.6,13.15 | 14.6,13.15 14.73,13.26 15.14,13.26 15.46,12.99 U2.14 | v14.3,14.22 14.3,13.44 14.6,13.15
  Bottom 0.254: R54.2 14.4,15.39 14.25,15.24 14.25,14.28 v14.3,14.22
N$19  (via drill 0.3)
  Top 0.178: U1.4 42.23,8.86 43.46,10.08 43.46,14.78 44.02,15.34 69.93,15.34 v72.69,18.11
  Bottom 0.178: v72.69,18.11 72.69,19.32 R56.2
N$20
  Bottom 0.406: U6.3 66.69,27.58 K1.-9-R
N$22
  Top 0.254: D2.C 26.01,28.46 R30.2
N$24  (via drill 0.3)
  Top 0.178: U7.4 64.34,43.06 64.47,43.18
  Top 0.406: R39.2 67.08,42.27 65.89,43.46 65.89,43.79 C4.1 | Q2.3 72.28,34.51 73,35.23 74.22,35.23 | 74.22,35.23 74.24,35.23 F1.2 | 74.22,35.23 74.4,35.41
  Top 1.016: 74.4,35.41 74.4,36.7 v73.94,37.16 | v65.13,44.63 65.1,44.63 C4.1
  Bottom 1.016: v73.94,37.16 69.11,37.16 68.81,37.47 68.81,42.82 66.9,44.63 v65.13,44.63
  pour Top (no thermals): 64.31,41.63 64.29,45.36 64.52,45.64 65.79,45.64 66.07,45.36 66.07,43.41 65.86,43.21 64.64,43.21 64.36,42.93 64.36,41.73
N$27
  Bottom 0.178: C2.1 76.78,25.81 U3.6
N$28
  Top 0.178: R40.2 67.89,40.11 68.15,40.36 D10.P$2
  Top 0.406: D10.P$2 69.51,38.55 R44.1
N$29
  Bottom 0.178: U4.6 55.5,6.96 56.01,7.47 60.72,7.47 | 60.72,7.47 R3.1 | 60.72,7.47 62.71,7.47 63.14,7.04 63.14,6.07 J6.4
N$30
  Top 0.406: D10.P$1 71.71,42.02 R39.1
N$31
  Top 0.178: U7.7 63.34,36.43 R42.2 63,36.27 63.63,36.27 64.34,35.56 64.34,33.4 64.59,33.15 68.4,33.15 68.71,33.45 68.71,36.2 69.12,36.61 Q2.2
N$32  (via drill 0.3)
  Top 0.178: v65.13,42.55 64.85,42.37 64.85,41.58 U7.3
  Bottom 0.178: C5.2 64.64,42.98 v65.13,42.55
N$33
  Bottom 0.178: U4.7 54.23,6.88 55.4,8.05 58.78,8.05 59.41,8.69 59.41,9.07 59.77,9.42 60.95,9.42 R3.2 60.95,9.41 60.83,9.3 62.84,9.3 63.22,9.68 63.22,11.79 J6.1
N$34
  Top 0.254: R34.1 7.52,35.04 R21.P$1
  Bottom 0.254: R21.P$1 8.34,35.87 4.22,35.87 2.95,34.59 QB7.3 R28.2
  Bottom 0.381: R21.P$1 9.8,39.67
  Bottom 0.406: 9.8,39.67 J9.2
N$35
  Top 0.178: U7.1 66.67,41.27 66.83,41.12 66.83,38.08 | 66.83,38.08 66.83,36.69 C6.1 67.1,36.22 64.44,36.22 64.08,36.58 64.08,37.29 64.34,37.55 U7.9 | U7.12 U7.11 65.81,38.08 65.84,38.05 66.8,38.05 66.83,38.08
N$36  (via drill 0.3)
  Top 0.178: v61.65,44.76 61.65,44.83 61.54,44.93
  Bottom 0.178: C5.1 61.7,44.7 v61.65,44.76
  pour Top (no thermals): 60.38,45.72 63.09,45.72 63.58,45.24 63.58,43.59 63.86,43.31 63.86,41.33 63.8,41.33 63.8,42.27 63.63,42.44 62.66,42.44 62.26,42.04 60.45,42.04 60.2,42.29 60.2,45.54
N$38  (via drill 0.38)
  Top 0.254: U2.22 11.46,20.24 v11.58,20.37
  Bottom 0.254: R27.1 8.88,22.23 C19.1 C18.2 11.58,21.55 v11.58,20.37
N$39
  Top 0.178: U1.16 35.1,17.27 35.46,17.63 45.06,17.63 46.28,18.85 J1.5
N$40  (via drill 0.38)
  Top 0.254: U2.24 10.46,15.1 7.26,18.29 v7.26,19.86
  Bottom 0.254: R28.1 3.37,23.16 4.72,23.16 5.07,22.82 C20.1 C19.2 7.18,20.46 v7.26,19.86
N$41
  Top 0.254: D3.C 21.43,28.46 R31.2
N$42
  Top 0.406: R44.2 71.31,36.71 Q2.1
N$43
  Top 0.254: D4.C 16.86,28.46 R32.2
N$44
  Top 0.254: D5.C 12.29,28.46 R33.2
N$46
  Bottom 0.254: R9.1 11.24,30.41 QB5.1
N$47
  Top 0.254: D6.C 7.72,28.46 R34.2
N$48
  Top 0.254: D5.A R20.P$2
  Bottom 0.254: QB5.2 13.04,32.24 R20.P$2
N$49
  Bottom 0.254: R7.1 20.38,30.41 QB3.1
N$50
  Top 0.254: R33.1 12.09,35.04 R20.P$1
  Bottom 0.254: R20.P$1 11.9,34.85 9.04,34.85 8.53,34.34 8.53,33.33 7.52,32.31 QB6.3 R27.2
  Bottom 0.381: R20.P$1 14.38,40.95 J9.3
N$52
  Bottom 0.254: R11.1 2.1,30.41 QB7.1
N$53
  Top 0.254: R32.1 16.66,35.04 R17.P$1
  Bottom 0.254: R17.P$1 16.47,34.85 13.87,34.85 12.09,33.07 QB5.3 R26.2
  Bottom 0.381: R17.P$1 18.95,38.66 J9.4
N$54
  Top 0.254: D7.A R22.P$2
  Bottom 0.254: QB7.2 3.9,32.24 R22.P$2
N$56
  Top 0.254: D7.C 3.15,28.46 R35.2
N$57
  Bottom 0.254: R10.1 6.67,30.41 QB6.1
N$58
  Top 0.254: U1.18 33.5,18.36 34.87,19.74 36.04,19.74 J1.1
  Bottom 0.178: R4.1 36.56,22.34 36.22,22 36.22,19.91 J1.1
N$64
  Top 0.254: D6.A R21.P$2
  Bottom 0.254: QB6.2 8.47,32.24 R21.P$2
N$66  (via drill 0.3)
  Top 0.178: U7.10 64.84,37.11 v65,36.91
  Bottom 0.178: v65,36.91 63.55,36.91 63.2,37.31 63.2,38.3 R43.2 63.15,38.33 R41.1 60.97,38.35 C7.2
N$67
  Top 0.254: R29.1 30.38,35.04 R14.P$1
  Bottom 0.254: 25.81,25.2 R23.2 QB2.3 | J9.7 24.03,40.95 | 29.36,35.1 29.62,34.85
  Bottom 0.381: QB2.3 25.81,33.33 27.33,34.85 29.62,34.85 30.18,34.85 R14.P$1 | 24.03,40.95 26.31,38.66 28.6,38.66 29.36,37.9 29.36,35.1
N$68
  Top 0.254: R30.1 25.81,35.04 R15.P$1
  Bottom 0.254: 28.09,37.39 R15.P$1 27.64,36.88 25.61,34.85 22.76,34.85 21.23,33.33 QB3.3 R24.2 | J9.6 21.74,41.2
  Bottom 0.381: 21.74,41.2 26.06,36.88 27.64,36.88
N$69
  Top 0.254: R31.1 21.23,35.04 R16.P$1
  Bottom 0.254: R25.2 QB4.3 16.66,33.33 18.19,34.85 21.04,34.85 R16.P$1 23.07,37.33
  Bottom 0.381: 23.07,37.33 J9.5
N$70
  Bottom 0.254: R5.1 29.53,30.41 QB1.1
N$71
  Top 0.254: 32.66,30.53 D1.A R14.P$2
  Bottom 0.254: QB1.2 31.33,31.73 32.66,33.07 R14.P$2
N$72
  Bottom 0.254: R6.1 24.96,30.41 QB2.1
N$73
  Top 0.254: D2.A R15.P$2
  Bottom 0.254: QB2.2 26.76,32.24 R15.P$2
N$74
  Top 0.254: D3.A R16.P$2
  Bottom 0.254: QB3.2 22.18,32.24 R16.P$2
N$76
  Bottom 0.254: R8.1 15.81,30.41 QB4.1
N$77
  Top 0.254: D4.A R17.P$2
  Bottom 0.254: QB4.2 17.61,32.24 R17.P$2
N$78  (via drill 0.3)
  Top 0.406: U8.2 50.96,32.05 v50.55,32.46
  Bottom 0.406: v50.55,32.46 49.53,32.46 | 49.53,32.46 47.17,32.46 R12.5 R12.6 R12.7 R12.8 | R13.6 R13.7 R13.8 49.34,32.65 49.53,32.46
N$79  (via drill 0.3)
  Top 0.254: U2.18 13.46,16.05 14.02,16.61 15.7,16.61 v16.31,17.22
  Bottom 0.254: C16.2 C17.1 | C17.1 16.5,23.42 R25.1 | v16.31,17.22 16.31,21.45 C17.1
RSET  (via drill 0.3)
  Top 0.178: v72.16,24.49 72.16,28.52 v71.55,29.13
  Bottom 0.178: R56.1 72.54,24.11 v72.16,24.49 | v71.55,29.13 71.55,30.66 71.25,30.96 69.32,30.96 69.24,30.89
  Bottom 0.406: U6.5 69.24,30.89 69.24,31.94 R58.2
RX1  (via drill 0.3)
  Top 0.178: U1.1 40.08,2.56 v40.36,2.29 | D8.C 54.13,19.02 | 54.13,19.02 53.87,19.02 53.7,18.85 v53.7,18.03 | v50.72,12.9 50.72,9.17 51.1,8.79 51.92,8.79 v52.72,7.99 | RX.2 RX.1 54.2,19.09 54.13,19.02
  Bottom 0.178: v40.36,2.29 48.13,2.29 48.77,2.92 48.77,5.71 50.6,7.54 52.27,7.54 v52.72,7.99 52.93,8.2 52.93,10.31 U4.1 | v53.7,18.03 53.7,13.97 53.11,13.39 51.21,13.39 v50.72,12.9
S1  (via drill 0.3, 0.38)
  Top 0.254: v4.47,24.94 5.99,23.42 5.99,18.64 9.75,14.88 9.75,14.28 v9.09,13.61 | v9.25,4.62 9.45,4.83 10.39,4.83 U2.25
  Bottom 0.254: v4.47,24.94 4.47,26.05 R11.2 | v9.09,13.61 9.09,4.78 v9.25,4.62
S2  (via drill 0.38)
  Top 0.254: U2.23 10.96,15.51 9.2,17.27 9.2,23.27 v9.04,23.42
  Bottom 0.254: v9.04,23.42 9.04,26.05 R10.2
S3  (via drill 0.38)
  Top 0.254: U2.21 11.96,19.07 13.61,20.73 v13.61,24.94
  Bottom 0.254: v13.61,24.94 13.61,26.05 R9.2
S4  (via drill 0.38)
  Top 0.254: v18.19,24.69 16,22.5 16,18.24 14.88,17.12 13.72,17.12 12.96,16.36 U2.19
  Bottom 0.254: v18.19,24.69 18.19,26.05 R8.2
S7  (via drill 0.38)
  Top 0.254: v22.76,25.2 22.71,25.15 20.52,25.15 17.58,22.2 17.58,16.36 15.96,14.74 U2.13
  Bottom 0.254: v22.76,25.2 22.76,26.05 R7.2
S8  (via drill 0.38)
  Top 0.254: v27.33,25.45 25.49,23.36 25.14,23.01 20.68,23.01 19.61,21.95 19.61,16.2 16.95,13.55 U2.11
  Bottom 0.254: v27.33,25.45 27.33,26.61 R6.2
S9  (via drill 0.38)
  Top 0.254: U2.9 17.95,13.03 21.74,16.82 23.27,16.82 26.31,19.86 26.31,21.89 28.85,24.43 28.85,26.26 29.36,26.77 32.46,26.77 v32.79,27.1
  Bottom 0.254: v32.79,27.1 31.41,27.1 R5.2
SET
  Bottom 0.178: 69.24,25.64 68.9,25.64 68.58,25.32 68.58,21.17 R55.1
  Bottom 0.406: U6.2 69.24,25.64 R57.2
SHORT  (via drill 0.3)
  Top 0.254: U2.6 19.45,12.7 19.86,13.11 20.47,13.11 | 20.47,13.11 21.95,13.11 | 21.95,13.11 21.95,11.61 U2.1 U2.2 | U2.4 20.45,13.09 20.47,13.11 | 21.95,13.11 21.95,13.87 v22.71,14.63
  Bottom 0.254: R18.1 32.24,23.42 C13.1 32.41,21.48 32.41,20.02 31.85,19.46 29.52,19.46 24.69,14.63 v22.71,14.63
TEMP1
  Top 0.254: U1.20 31.9,19.1 38,25.2 42.37,25.2 42.82,25.65 42.82,27.05 J2.3
  Bottom 0.178: R12.1 43.28,29.25 42.88,28.85 42.88,27.2 J2.3
TEMP2
  Top 0.254: U1.21 31.1,19.16 37.74,25.81 37.74,27.05 J2.1
  Bottom 0.178: R12.2 38.79,30.11 37.62,28.93 37.62,27.18 J2.1
TEMP3
  Top 0.254: U1.22 30.3,19.28 36.07,25.04 36.07,30.94 36.78,31.65 41.99,31.65 42.7,32.36 J3.3
  Bottom 0.178: R12.4 43.3,31.75 42.7,32.36 42.7,34.44 J3.3
TEMP4
  Top 0.254: U1.24 27.27,13.68 27.03,13.92 27.03,16.82 35.56,25.35 35.56,33.53 36.47,34.44 37.26,34.44 | 37.9,34.44 37.26,34.44 | 37.26,34.44 J3.1
  Bottom 0.178: R12.3 38.28,30.91 37.54,31.65 37.54,34.37 J3.1
TEMP5
  Top 0.254: J4.3 42.82,40.34 42.01,39.52 35.61,39.52 35,38.91 35,25.6 26.42,17.02 26.42,13.26 26.82,12.85 28.47,12.85 U1.25
  Bottom 0.178: J4.3 42.95,41.71 42.95,39.7 43.07,39.59 43.38,39.27 45.34,39.27 45.72,38.89 45.72,37.92 46.3,37.34 R13.2
TEMP6
  Top 0.254: U1.26 26.48,12.07 25.65,12.9 25.65,17.37 34.09,25.81 34.09,40.95 35,41.86 37.11,41.86 J4.1
  Bottom 0.178: J4.1 37.77,41.81 37.77,38.89 38.23,38.42 38.24,38.43 44.83,38.43 45.14,38.12 45.14,37.59 46.23,36.49 R13.1
TEMP7  (via drill 0.3)
  Top 0.178: U1.27 26.31,11.28 v25.93,10.9
  Bottom 0.178: J5.2 53.24,40.54 52.63,39.93 47.45,39.93 | 47.45,39.93 46.86,39.93 46.53,39.6 46.53,38.41 46.81,38.12 47.57,38.12 R13.3 | v25.93,10.9 25.93,13.56 28.47,16.1 28.47,17.27 29.79,18.59 32.28,18.64 34.09,20.45 34.14,29.84 35.36,31.06 35.36,42.8 36.37,43.81 47.12,43.81 47.42,43.51 47.42,39.95 47.45,39.93
TFET
  Top 0.254: U1.19 32.7,18.96 35.43,21.69 48.38,21.69 R46.2
TX1  (via drill 0.3)
  Top 0.178: U1.44 38.28,3.53 v38.58,3.23 | D9.C 58.37,18.52 58.85,18.03 59.97,18.03 v60.02,18.09 60.2,18.26 60.2,25.2 59.61,25.78 57.51,25.78 57.1,26.19 TX.1 TX.2
  Bottom 0.178: v38.58,3.23 47.62,3.23 48.18,3.79 48.18,5.87 50.57,8.26 51.59,8.26 52.07,8.74 52.07,11.73 52.27,11.94 56.54,11.94 | 56.54,11.94 56.79,11.68 56.79,10.36 U4.4 | v60.02,18.09 57.76,18.09 57.43,17.75 57.43,12.83 56.54,11.94
U4  (via drill 0.3)
  Top 0.178: U1.43 37.48,1.76 v37.8,1.45 | R/D.2 R/D.1 | R/D.1 59.97,27.58 60.05,27.51 60.05,28.08 R/D.1 | R/D.1 59.97,27.41 61.59,25.78 61.59,18.47 v62.05,18.01
  Bottom 0.178: v37.8,1.45 48.21,1.45 49.53,2.77 49.53,5.51 50.88,6.86 53.09,6.86 54.18,7.95 54.18,8.69 | 54.18,8.69 54.18,10.29 U4.2 | v62.05,18.01 62.05,17.09 61.54,16.59 59.26,16.59 58.98,16.31 58.98,9.93 57.81,8.76 54.25,8.76 54.18,8.69
  Bottom 0.254: U4.2 U4.3
VEXTERNAL  (via drill 0.3)
  Top 0.178: U1.11 41.4,14.46 43.46,16.51 65.58,16.51 v66.06,16.99
  Bottom 0.178: R49.2 C1.1 66.47,3.67 66.47,5.38 66.06,5.79 v66.06,16.99 | R49.2 | R49.2 R48.1
VREF1
  Top 0.254: U2.35 15.46,2.7 13.82,1.07 12.33,1.07 C22.1
VREF2
  Top 0.254: C21.1 14.22,2.79 14.96,3.52 U2.34

### Text on the board
tPlace: + | - | 7+ | D10 | NEG | S | G | S | G | G | S
_tNames: R. Johnson